# Altium schematic sheet Outputs.SchDoc
size A4
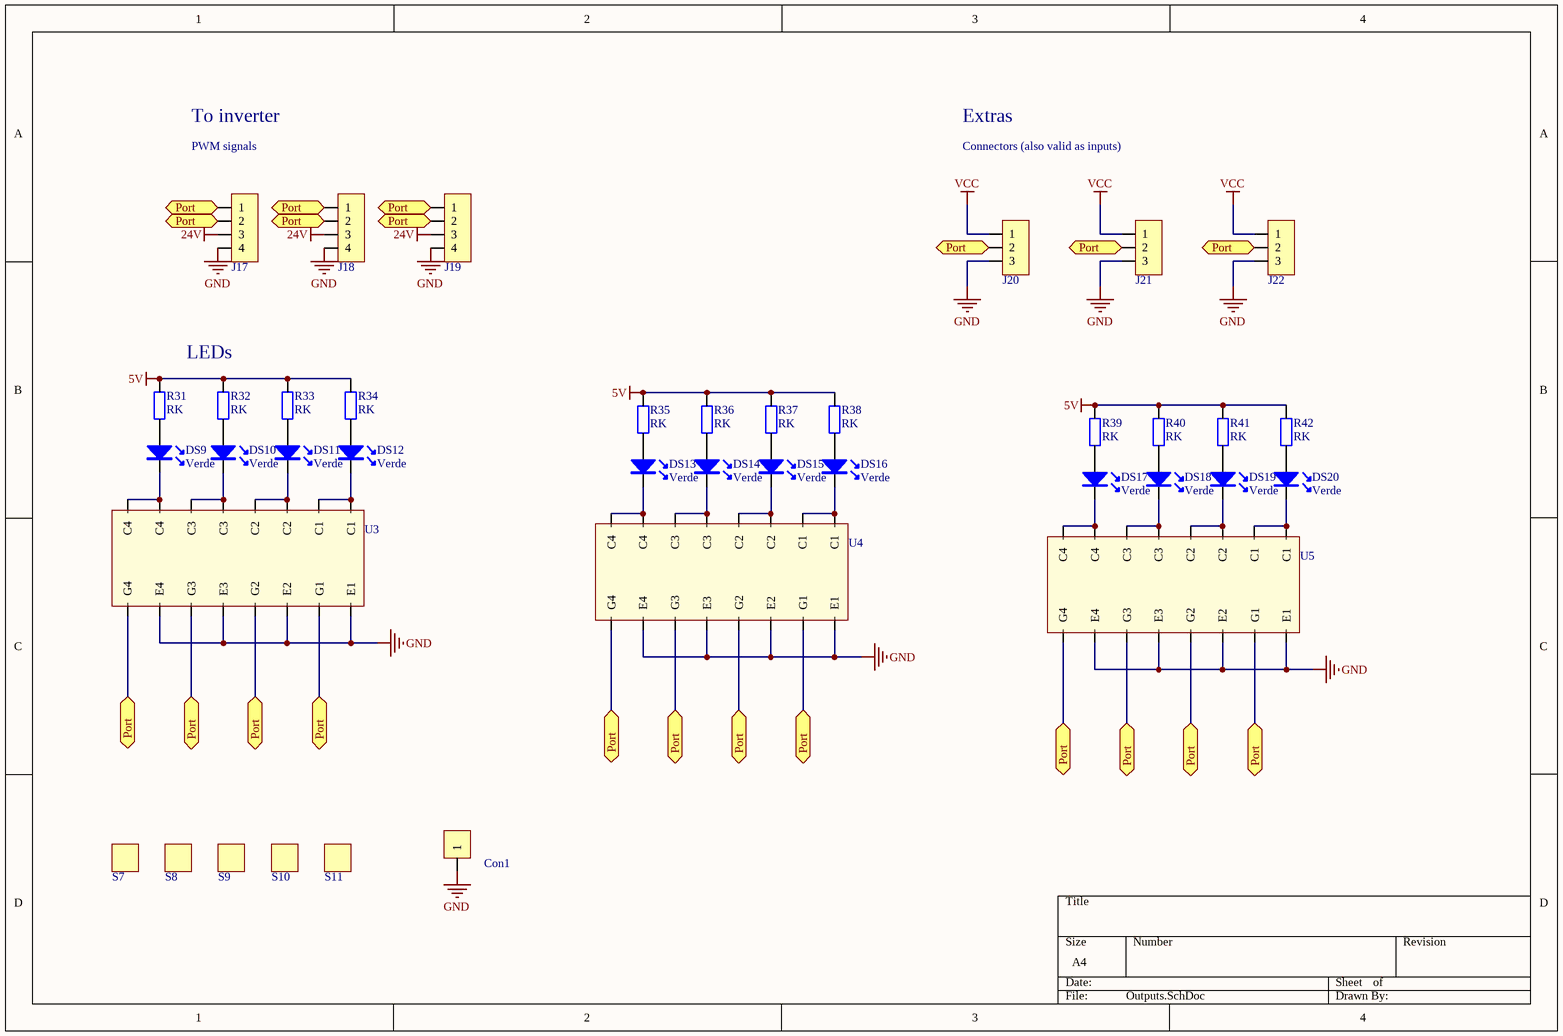
[diagram p0: Outputs.SchDoc]

## Parts
Con1  CON1  [ShortPad]  (value not drawn)
DS9  Verde  [Led 3mm]
DS10  Verde  [Led 3mm]
DS11  Verde  [Led 3mm]
DS12  Verde  [Led 3mm]
DS13  Verde  [Led 3mm]
DS14  Verde  [Led 3mm]
DS15  Verde  [Led 3mm]
DS16  Verde  [Led 3mm]
DS17  Verde  [Led 3mm]
DS18  Verde  [Led 3mm]
DS19  Verde  [Led 3mm]
DS20  Verde  [Led 3mm]
J17  Cleva 2 vias  [Con4_KK_256]  (value not drawn)
J18  Cleva 2 vias  [Con4_KK_256]  (value not drawn)
J19  Cleva 2 vias  [Con4_KK_256]  (value not drawn)
J20  Cleva 2 vias  [Con3_KK_256]  (value not drawn)
J21  Cleva 2 vias  [Con3_KK_256]  (value not drawn)
J22  Cleva 2 vias  [Con3_KK_256]  (value not drawn)
R31  RK  [1206]
R32  RK  [1206]
R33  RK  [1206]
R34  RK  [1206]
R35  RK  [1206]
R36  RK  [1206]
R37  RK  [1206]
R38  RK  [1206]
R39  RK  [1206]
R40  RK  [1206]
R41  RK  [1206]
R42  RK  [1206]
S7  Support  [Support]  (value not drawn)
S8  Support  [Support]  (value not drawn)
S9  Support  [Support]  (value not drawn)
S10  Support  [Support]  (value not drawn)
S11  Support  [Support]  (value not drawn)
U3  MMPQ3904  [SO-16]  (value not drawn)
U4  MMPQ3904  [SO-16]  (value not drawn)
U5  MMPQ3904  [SO-16]  (value not drawn)

## Ports
Port

## Nets
5V: R31.1 R32.1 R33.1 R34.1 R35.1 R36.1 R37.1 R38.1 R39.1 R40.1 R41.1 R42.1
24V: J17.3 J18.3 J19.3
GND: Con1.1 J17.4 J18.4 J19.4 J20.3 J21.3 J22.3 U3.10(E4) U3.12(E3) U3.14(E2) U3.16(E1) U4.10(E4) U4.12(E3) U4.14(E2) U4.16(E1) U5.10(E4) U5.12(E3) U5.14(E2) U5.16(E1)
VCC: J20.1 J21.1 J22.1
Port: J17.1 J17.2 J18.1 J18.2 J19.1 J19.2 J20.2 J21.2 J22.2 U3.9(G4) U3.11(G3) U3.13(G2) U3.15(G1) U4.9(G4) U4.11(G3) U4.13(G2) U4.15(G1) U5.9(G4) U5.11(G3) U5.13(G2) U5.15(G1) ; port Port
NetDS9_A: DS9.A R31.2
NetDS9_K: DS9.K U3.7(C4) U3.8(C4)
NetDS10_A: DS10.A R32.2
NetDS10_K: DS10.K U3.5(C3) U3.6(C3)
NetDS11_A: DS11.A R33.2
NetDS11_K: DS11.K U3.3(C2) U3.4(C2)
NetDS12_A: DS12.A R34.2
NetDS12_K: DS12.K U3.1(C1) U3.2(C1)
NetDS13_A: DS13.A R35.2
NetDS13_K: DS13.K U4.7(C4) U4.8(C4)
NetDS14_A: DS14.A R36.2
NetDS14_K: DS14.K U4.5(C3) U4.6(C3)
NetDS15_A: DS15.A R37.2
NetDS15_K: DS15.K U4.3(C2) U4.4(C2)
NetDS16_A: DS16.A R38.2
NetDS16_K: DS16.K U4.1(C1) U4.2(C1)
NetDS17_A: DS17.A R39.2
NetDS17_K: DS17.K U5.7(C4) U5.8(C4)
NetDS18_A: DS18.A R40.2
NetDS18_K: DS18.K U5.5(C3) U5.6(C3)
NetDS19_A: DS19.A R41.2
NetDS19_K: DS19.K U5.3(C2) U5.4(C2)
NetDS20_A: DS20.A R42.2
NetDS20_K: DS20.K U5.1(C1) U5.2(C1)

## Notes on the sheet
- (near J17) PWM signals
- To inverter
- Extras
- Connectors (also valid as inputs)
- LEDs

## Library data of the parts
DS9-DS20 = Led
J17-J19 = Con_4
J20-J22 = Con_3
R31-R42 = Resistencia: Potencia: 1/4W